# Altium schematic sheet IO.SchDoc
size A
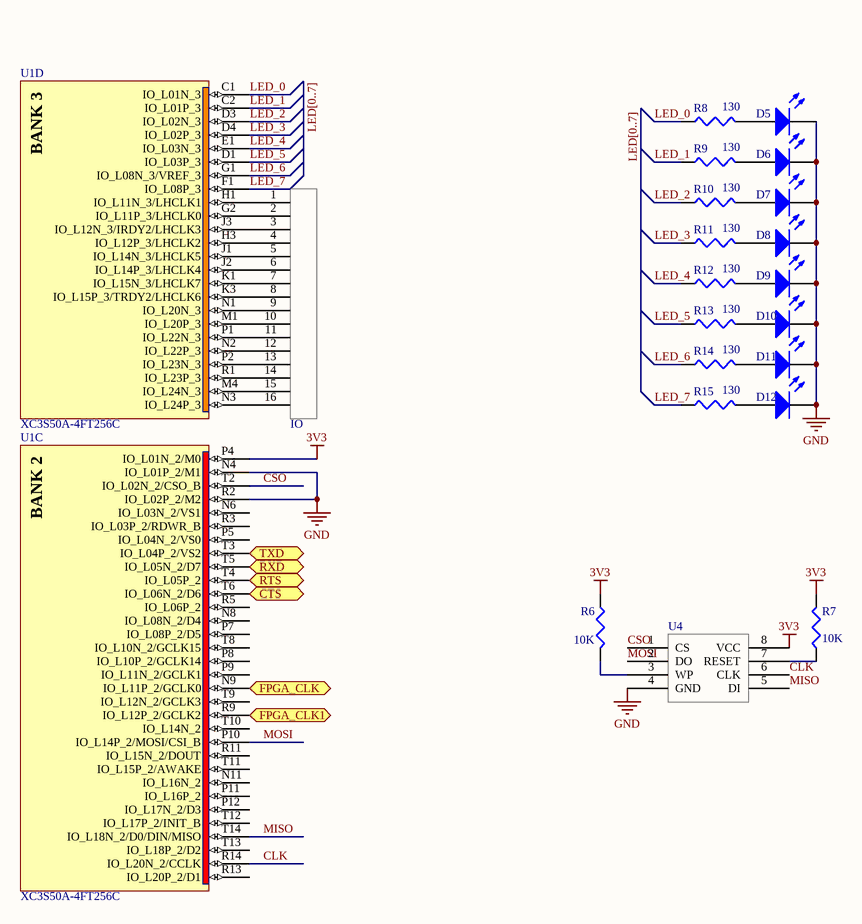
[diagram p0: IO.SchDoc]

## Parts
?  IO  [PCBComponent_1]
D5  LED3  [1608[0603]]  (value not drawn)
D6  LED3  [1608[0603]]  (value not drawn)
D7  LED3  [1608[0603]]  (value not drawn)
D8  LED3  [1608[0603]]  (value not drawn)
D9  LED3  [1608[0603]]  (value not drawn)
D10  LED3  [1608[0603]]  (value not drawn)
D11  LED3  [1608[0603]]  (value not drawn)
D12  LED3  [1608[0603]]  (value not drawn)
R6  value 10K  [J1-0603]  (hidden comment: Res3)
R7  value 10K  [J1-0603]  (hidden comment: Res3)
R8  value 130  [J1-0603]  (hidden comment: Res3)
R9  value 130  [J1-0603]  (hidden comment: Res3)
R10  value 130  [J1-0603]  (hidden comment: Res3)
R11  value 130  [J1-0603]  (hidden comment: Res3)
R12  value 130  [J1-0603]  (hidden comment: Res3)
R13  value 130  [J1-0603]  (hidden comment: Res3)
R14  value 130  [J1-0603]  (hidden comment: Res3)
R15  value 130  [J1-0603]  (hidden comment: Res3)
U1  XC3S50A-4FT256C  [FT256]  (parts C,D of 9)
U4  W25Q80  [QFN127P500X600X80_HS-9N]  (value not drawn)

## Ports
CTS (out), FPGA_CLK1 (in), FPGA_CLK (in), RTS (in), RXD (out), TXD (in)

## Nets
3V3: R6.1 R7.2 U1.P4(IO_L01N_2/M0) U4.8(VCC)
GND: D5.2(K) D6.2(K) D7.2(K) D8.2(K) D9.2(K) D10.2(K) D11.2(K) D12.2(K) U1.N4(IO_L01P_2/M1) U1.R2(IO_L02P_2/M2) U4.4(GND)
CLK: U1.R14(IO_L20N_2/CCLK) U4.6(CLK)
CSO: U1.T2(IO_L02N_2/CSO_B) U4.1(CS)
CTS: U1.T6(IO_L06N_2/D6) ; port CTS
FPGA_CLK: U1.N9(IO_L11P_2/GCLK0) ; port FPGA_CLK
FPGA_CLK1: U1.R9(IO_L12P_2/GCLK2) ; port FPGA_CLK1
LED_0: R8.1 U1.C1(IO_L01N_3)
LED_1: R9.1 U1.C2(IO_L01P_3)
LED_2: R10.1 U1.D3(IO_L02N_3)
LED_3: R11.1 U1.D4(IO_L02P_3)
LED_4: R12.1 U1.E1(IO_L03N_3)
LED_5: R13.1 U1.D1(IO_L03P_3)
LED_6: R14.1 U1.G1(IO_L08N_3/VREF_3)
LED_7: R15.1 U1.F1(IO_L08P_3)
MISO: U1.T14(IO_L18N_2/D0/DIN/MISO) U4.5(DI)
MOSI: U1.P10(IO_L14P_2/MOSI/CSI_B) U4.2(DO)
RTS: U1.T4(IO_L05P_2) ; port RTS
RXD: U1.T5(IO_L05N_2/D7) ; port RXD
TXD: U1.T3(IO_L04P_2/VS2) ; port TXD
Net?_1: ?.1 U1.H1(IO_L11N_3/LHCLK1)
Net?_2: ?.2 U1.G2(IO_L11P_3/LHCLK0)
Net?_3: ?.3 U1.J3(IO_L12N_3/IRDY2/LHCLK3)
Net?_4: ?.4 U1.H3(IO_L12P_3/LHCLK2)
Net?_5: ?.5 U1.J1(IO_L14N_3/LHCLK5)
Net?_6: ?.6 U1.J2(IO_L14P_3/LHCLK4)
Net?_7: ?.7 U1.K1(IO_L15N_3/LHCLK7)
Net?_8: ?.8 U1.K3(IO_L15P_3/TRDY2/LHCLK6)
Net?_9: ?.9 U1.N1(IO_L20N_3)
Net?_10: ?.10 U1.M1(IO_L20P_3)
Net?_11: ?.11 U1.P1(IO_L22N_3)
Net?_12: ?.12 U1.N2(IO_L22P_3)
Net?_13: ?.13 U1.P2(IO_L23N_3)
Net?_14: ?.14 U1.R1(IO_L23P_3)
Net?_15: ?.15 U1.M4(IO_L24N_3)
Net?_16: ?.16 U1.N3(IO_L24P_3)
NetD5_1: D5.1(A) R8.2
NetD6_1: D6.1(A) R9.2
NetD7_1: D7.1(A) R10.2
NetD8_1: D8.1(A) R11.2
NetD9_1: D9.1(A) R12.2
NetD10_1: D10.1(A) R13.2
NetD11_1: D11.1(A) R14.2
NetD12_1: D12.1(A) R15.2
NetR6_2: R6.2 U4.3(WP)
NetR7_1: R7.1 U4.7(RESET)

Not connected (* = marked no-connect by the designer): U1 N6(IO_L03N_2/VS1) N8(IO_L08N_2/D4) N11(IO_L16N_2) P5(IO_L04N_2/VS0) P7(IO_L08P_2/D5) P8(IO_L10P_2/GCLK14) P9(IO_L11N_2/GCLK1) P11(IO_L16P_2) P12(IO_L17N_2/D3) R3(IO_L03P_2/RDWR_B) R5(IO_L06P_2) R11(IO_L15N_2/DOUT) R13(IO_L20P_2/D1) T8(IO_L10N_2/GCLK15) T9(IO_L12N_2/GCLK3) T10(IO_L14N_2) T11(IO_L15P_2/AWAKE) T12(IO_L17P_2/INIT_B) T13(IO_L18P_2/D2)

## Buses and harness runs
bus LED[0..7]

## Notes on the sheet
- (in symbol XC3S50A-4FT256C, part C) BANK 2
- (in symbol XC3S50A-4FT256C, part D) BANK 3

## Library data of the parts
? U4 = Component_1
D5-D12 = LED3: Typical BLUE SiC LED; Published: 8-Jun-2000; LatestRevisionDate: 17-Dec-2003; LatestRevisionNote: PCB Footprint replaced.; DatasheetVersion: 16-Apr-2002; PackageVersion: 16-Apr-2002; PackageReference: 3.5X2.8X1.9; Publisher: Altium Limited; PackageDescription: SM LED; 2 C-Bend Leads; Body 3.5 x 2.8 x 1.9 mm, inc leads (LxWxH typ)
R6-R15 = Res3: Resistor; Published: 8-Jun-2000; LatestRevisionDate: 29-May-2009; LatestRevisionNote: IPC-7351 Footprint Added.; PackageReference: J1-0603; Publisher: Altium Limited; PackageDescription: Chip Resistor
U1 = XC3S50A-4FT256C: Spartan-3A I/O Optimized FPGA, 144 User I/Os, 256-Ball FTBGA, Standard Performance, Commercial Grade; Published: 12-Dec-2006; LatestRevisionDate: 24-Apr-2009; LatestRevisionNote: Updated to datasheet version 1.8 Mar-2009; DatasheetVersion: ver1.8, Mar-2009; PackageVersion: ver1.3, Oct-2007; PackageReference: FT256; Publisher: Altium Limited; PackageDescription: 256-Ball Fine Pitch Thin Ball Grid Array 1.00 mm Pitch (FT256); Supplier 1: Digi-Key; Supplier Part Number 1: XC3S50A-4FT256C-ND; Code_JEDEC: MS-034-AAF-1*; ComponentLink1Description: Spartan-3A Datasheet; ComponentLink1URL: http://www.xilinx.com/support/documentation/data_sheets/ds529.pdf; ComponentLink2Description: FT256 Package Drawing; ComponentLink2URL: http://www.xilinx.com/support/documentation/package_specs/ft256.pdf; ComponentLink3Description: Spartan-3A Documents; ComponentLink3URL: http://www.xilinx.com/support/documentation/spartan-3a.htm; ComponentLink4Description: Xilinx.com Home; ComponentLink4URL: http://www.xilinx.com